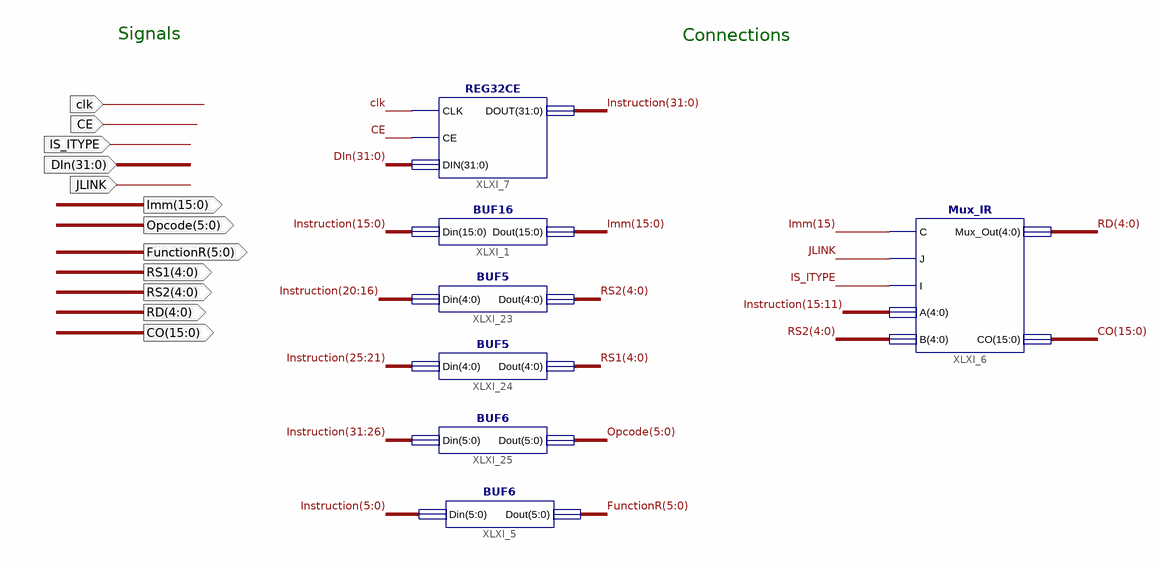
[diagram p0: schematic sheet 1]
// Xilinx ISE schematic Full_IR_Inv.sch (spartan6) as structural Verilog: 7 symbols, 12 ports
module Full_IR_Inv (
  input  clk,
  input  CE,
  input  [31:0] DIn,
  input  JLINK,
  input  IS_ITYPE,
  output [4:0] RS2,
  output [4:0] RS1,
  output [5:0] FunctionR,
  output [15:0] Imm,
  output [5:0] Opcode,
  output [15:0] CO,
  output [4:0] RD
);

  wire [31:0] Instruction;

  REG32CE XLXI_7 (.CLK(clk), .CE(CE), .DIN(DIn), .DOUT(Instruction));
  BUF16 XLXI_1 (.Din(Instruction[15:0]), .Dout(Imm));
  BUF6 XLXI_5 (.Din(Instruction[5:0]), .Dout(FunctionR));
  BUF5 XLXI_23 (.Din(Instruction[20:16]), .Dout(RS2));
  BUF5 XLXI_24 (.Din(Instruction[25:21]), .Dout(RS1));
  BUF6 XLXI_25 (.Din(Instruction[31:26]), .Dout(Opcode));
  Mux_IR XLXI_6 (.C(Imm[15]), .J(JLINK), .I(IS_ITYPE), .A(Instruction[15:11]), .B(RS2), .Mux_Out(RD), .CO(CO));

  // Notes on the sheet:
  //   Signals
  //   Connections
endmodule
